# EAGLE design usb2ax_v3.0 (EAGLE 5.11)
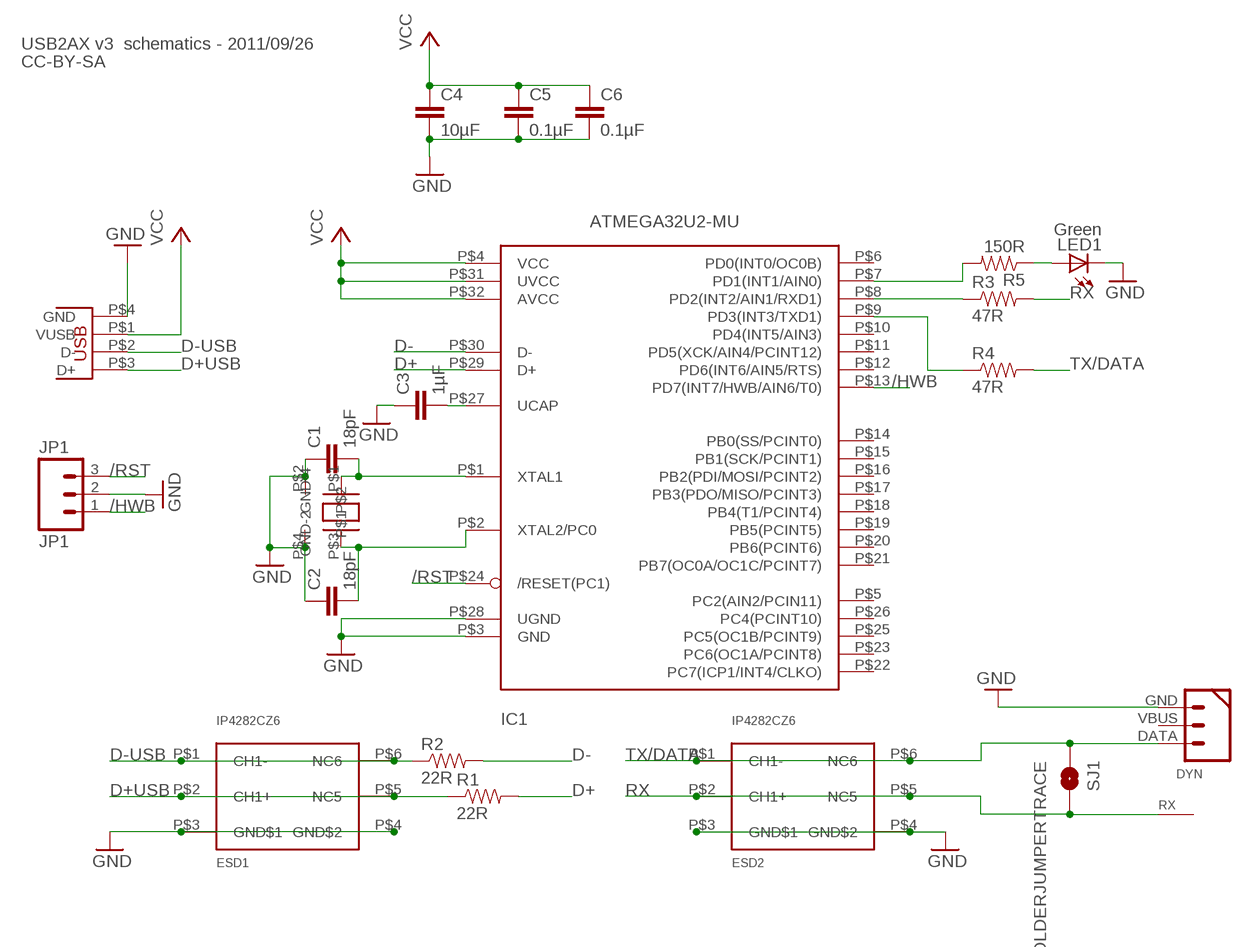
[diagram p0: schematic, sheet 1]

## Parts
C1  18pF  CAP0402-JLG  [0402-JLG]
C2  18pF  CAP0402-JLG  [0402-JLG]
C3  1µF  CAP0402-JLG  [0402-JLG]
C4  10µF  CAP0805  [0805]
C5  0.1µF  CAP0402-JLG  [0402-JLG]
C6  0.1µF  CAP0402-JLG  [0402-JLG]
DYN  DYNAMIXEL_3POS  [DYMANIXEL_3POS_RIGHT]
ESD1  IP4282CZ6  [SOT886]
ESD2  IP4282CZ6  [SOT886]
IC1  ATMEGA32U2-MU  ATMEGA32U2-AU  [QFN-32]
JP1  JP1  M031X03_NO_SILK  [1X03_NO_SILK]
LED1  Green  LED-0603  [0603-LED]
Q  CRYSTAL  [MODEL-403]
R1  22R  RESISTOR0402-JLG  [0402-JLG]
R2  22R  RESISTOR0402-JLG  [0402-JLG]
R3  47R  RESISTOR0402-JLG  [0402-JLG]
R4  47R  RESISTOR0402-JLG  [0402-JLG]
R5  150R  RESISTOR0402-JLG  [0402-JLG]
RX  PAD  [PAD_0.8]
SJ1  SOLDERJUMPERTRACE  [SJ_2S-TRACE]
USB  USB  USB-A-MALE-THT  [USB-A-THT]

## Nets
/HWB: IC1.P$13(PD7(INT7/HWB/AIN6/T0)) JP1.1
/RST: IC1.P$24(/RESET(PC1)) JP1.3
D+: IC1.P$29(D+) R1.P$2
D+USB: ESD1.P$2(CH1+) ESD1.P$5(NC5) R1.P$1 USB.P$3(D+)
D-: IC1.P$30(D-) R2.P$2
D-USB: ESD1.P$1(CH1-) ESD1.P$6(NC6) R2.P$1 USB.P$2(D-)
GND: C1.P$1 C2.P$1 C3.P$1 C4.2 C5.P$2 C6.P$2 DYN.GND ESD1.P$3(GND$1) ESD1.P$4(GND$2) ESD2.P$3(GND$1) ESD2.P$4(GND$2) IC1.P$3(GND) IC1.P$28(UGND) JP1.2 LED1.C Q.P$2(GND-2) Q.P$4(GND-4) USB.P$4(GND)
N$1: IC1.P$7(PD1(INT1/AIN0)) R5.P$2
N$3: C1.P$2 IC1.P$1(XTAL1) Q.P$1
N$4: C2.P$2 IC1.P$2(XTAL2/PC0) Q.P$3
N$5: IC1.P$8(PD2(INT2/AIN1/RXD1)) R3.P$1
N$10: C3.P$2 IC1.P$27(UCAP)
N$13: IC1.P$9(PD3(INT3/TXD1)) R4.P$1
N$14: LED1.A R5.P$1
RX: ESD2.P$2(CH1+) ESD2.P$5(NC5) R3.P$2 RX.PAD SJ1.2
TX/DATA: DYN.DATA ESD2.P$1(CH1-) ESD2.P$6(NC6) R4.P$2 SJ1.1
VCC: C4.1 C5.P$1 C6.P$1 IC1.P$4(VCC) IC1.P$31(UVCC) IC1.P$32(AVCC) USB.P$1(VUSB)
Unconnected: DYN.VBUS IC1.P$5(PC2(AIN2/PCIN11)) IC1.P$6(PD0(INT0/OC0B)) IC1.P$10(PD4(INT5/AIN3)) IC1.P$11(PD5(XCK/AIN4/PCINT12)) IC1.P$12(PD6(INT6/AIN5/RTS)) IC1.P$14(PB0(SS/PCINT0)) IC1.P$15(PB1(SCK/PCINT1)) IC1.P$16(PB2(PDI/MOSI/PCINT2)) IC1.P$17(PB3(PDO/MISO/PCINT3)) IC1.P$18(PB4(T1/PCINT4)) IC1.P$19(PB5(PCINT5)) IC1.P$20(PB6(PCINT6)) IC1.P$21(PB7(OC0A/OC1C/PCINT7)) IC1.P$22(PC7(ICP1/INT4/CLKO)) IC1.P$23(PC6(OC1A/PCINT8)) IC1.P$25(PC5(OC1B/PCINT9)) IC1.P$26(PC4(PCINT10))

## Notes on the sheet
- USB2AX v3  schematics - 2011/09/26
- CC-BY-SA

## Library data of the parts
C1-C6 = ParanoidStudio:CAP: Capacitor Standard 0603 ceramic capacitor, and 0.1" leaded capacitor.
DYN = ParanoidStudio:DYNAMIXEL_3POS
ESD1 ESD2 = ParanoidStudio:IP4282CZ6: Ultra-low capacitance ESD protection for high-speed interfaces
IC1 = ParanoidStudio:ATMEGA32U2: ATmega32u2 Pin compatible with the atmega8u2, atmega16u2 and atmega32u2 8, 16 or 32 K flash, 1K RAM, 512b EEPROM 8 bit and 16 bit timer (5 PWM total) UART, SPI (no I2C!) USB with 4 endpoints, LUFA compatible 22 I/O lines, analog comparator (no ADC!) Comes with DFU bootloader burned in!
JP1 = SparkFun-paranoidstudio:M03: Header 3 Standard 3-pin 0.1" header. Use with straight break away headers (SKU : PRT-00116), right angle break away headers (PRT-00553), swiss pins (PRT-00743), machine pins (PRT-00117), and female headers (PRT-00115). Molex polarized connector foot print use with SKU : PRT-08232 with associated crimp pins and housings.
LED1 = ParanoidStudio:LED
Q = ParanoidStudio:CRYSTAL
R1-R5 = ParanoidStudio:RESISTOR: Resistor Basic schematic elements and footprints for 0603, 1206, and PTH 1/10th watt (small) resistors.
RX = ParanoidStudio:PAD
SJ1 = SparkFun-paranoidstudio:SOLDERJUMPER: Solder Jumper Standard SMD solder jumper. Used to automate production. Two varients : Normally Open and Normally Closed are the same, but have different paste layers. NC will have a large amount of paste and should jumper during reflow.
USB = ParanoidStudio:USB

## Board
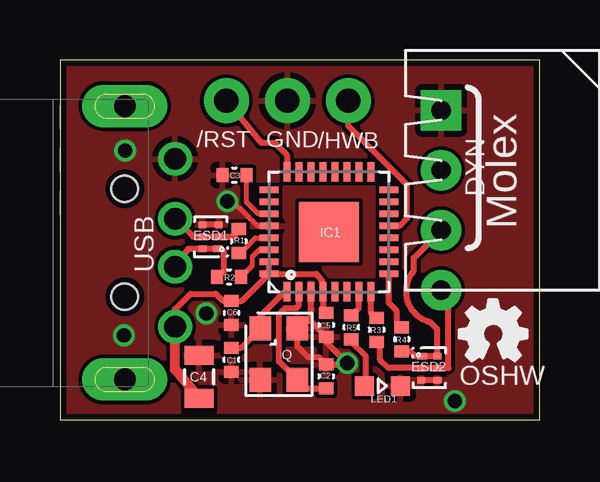
[diagram p1: board, top side]
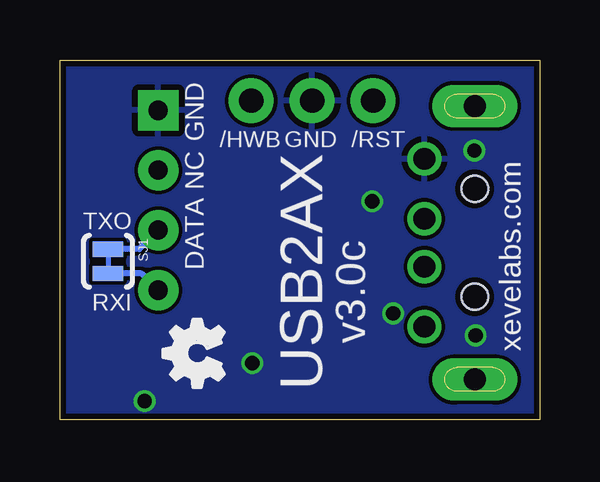
[diagram p2: board, bottom side, seen from below]

Size 20 x 15 mm. Coordinates in mm from the lower left corner, seen from the top.
Outline: 0,0 20,0 20,15 0,15 0,0
Copper layers (1*16): Top 0.035mm / dielectric 1.5mm / Bottom 0.035mm
Design rules "Fusion_eagle_rule_v1.1": minimum track width 6mil, minimum drill 12mil, track to track 6mil, track to pad 6mil, pad to pad 6mil, via to via 6mil, smd to smd 0mil, copper to edge 10mil, drill to drill 10mil, minimum pad ring 10mil, minimum via ring 6mil, stop-mask expansion 2mil, vias tented up to drill 100mil, thermal gap 10mil

### Footprints (pad centres in the part's own frame; a part is rotated, then mirrored left to right if it is on the bottom)
0402-JLG = smd 0.5 x 0.6: P$1 -0.5,0; P$2 0.5,0
0805 = smd 0.8 x 1.2: 1 -0.9,0; 2 0.9,0
DYMANIXEL_3POS_RIGHT = drill 0.8 pad 1.676 round: DATA 0,-5; VBUS 0,-2.5 | drill 0.8 pad 1.676 square: GND 0,0
SOT886 = smd 0.4 x 0.27: P$1 -0.3,0.5 | smd 0.325 x 0.27: P$2 -0.338,0; P$3 -0.338,-0.5; P$4 0.338,-0.5; P$5 0.338,0; P$6 0.338,0.5
QFN-32 = smd 0.285 x 0.8: P$1 -1.75,-2.5; P$2 -1.25,-2.5; P$3 -0.75,-2.5; P$4 -0.25,-2.5; P$5 0.25,-2.5; P$6 0.75,-2.5; P$7 1.25,-2.5; P$8 1.75,-2.5; P$17 1.75,2.5; P$18 1.25,2.5; P$19 0.75,2.5; P$20 0.25,2.5; P$21 -0.25,2.5; P$22 -0.75,2.5; P$23 -1.25,2.5; P$24 -1.75,2.5 | smd 0.8 x 0.285: P$9 2.5,-1.75; P$10 2.5,-1.25; P$11 2.5,-0.75; P$12 2.5,-0.25; P$13 2.5,0.25; P$14 2.5,0.75; P$15 2.5,1.25; P$16 2.5,1.75; P$25 -2.5,1.75; P$26 -2.5,1.25; P$27 -2.5,0.75; P$28 -2.5,0.25; P$29 -2.5,-0.25; P$30 -2.5,-0.75; P$31 -2.5,-1.25; P$32 -2.5,-1.75 | smd 2.5 x 2.5: P$33 0,0
1X03_NO_SILK = drill 1.016 pad 1.88 round: 1 0,0; 2 2.54,0; 3 5.08,0
0603-LED = smd 0.8 x 0.8: A -0.75,0; C 0.75,0
MODEL-403 = smd 1 x 0.9: P$1 -1.05,-0.75; P$2 1.1,-0.75; P$3 1.1,0.8; P$4 -1.05,0.8
PAD_0.8 = drill 0.8 pad 1.676 round: PAD 0,0
SJ_2S-TRACE = smd 0.635 x 1.27: 1 -0.508,0; 2 0.508,0
USB-A-THT = drill 0.9 round: P$1 2.1,-3.5; P$2 2.1,-1; P$3 2.1,1; P$4 2.1,3.5 | drill 0.9 pad 1.778 long: P$5 0,5.7; P$6 0,-5.7 | hole 1.1: 0,-2.25; 0,2.25

### Placement (x,y rotation side)
C1  7.15,2.5 90 top
C2  11.1,1.8 270 top
C3  7.28,10.2 0 top
C4  5.8,1.78 90 top
C5  11.1,3.95 270 top
C6  7.15,4.45 270 top
DYN  15.9,12.9 0 top
ESD1  6.29,7.63 180 top
ESD2  15.4,2.15 0 top
IC1  11.21,7.83 0 top
JP1  12.03,13.3 180 top
LED1  13.45,1.4 0 top
Q  9.1,2.75 270 top
R1  7.45,7.44 270 top
R2  7.05,5.95 0 top
R3  13.2,3.75 270 top
R4  14.25,3.35 270 top
R5  12.15,3.85 90 top
RX  15.9,5.4 0 top
SJ1  18,6.6 270 bottom
U$2  [OSHW_FILLX100_NOTEXT]  13.15,1.35 90 bottom
U$4  [OSHW_FILLX100_NOTEXT]  16.65,2.45 0 top
USB  2.7,7.38 0 top

### Tracks (layer width: path | path; a pad name or v marks a point on that pad's centre or on a via)
/HWB
  Top 0.254: IC1.P$13 14.15,8.08 14.47,8.4 14.47,9.8 12.03,12.25 JP1.1
/RST
  Top 0.254: IC1.P$24 9.46,11.04 8.95,11.55 8.39,11.55 JP1.3
D+
  Top 0.203: IC1.P$29 8.15,7.58 7.51,6.89 R1.P$2
D+USB
  Top 0.254: R1.P$1 7.29,7.63 ESD1.P$2 ESD1.P$5 5.54,7.63 USB.P$3
D-
  Top 0.203: IC1.P$30 8.3,7.08 8.03,6.8 8.03,6.42 R2.P$2
D-USB
  Top 0.254: R2.P$1 6.83,6.15 6.83,7 6.71,7.13 ESD1.P$1 ESD1.P$6 5.36,7.13 USB.P$2
GND  (via drill 0.6, 0.6 pad 0.25)
  Top 0.203: IC1.P$28 8.27,8.08 7.2,9.1 v6.97,9.1
  Top 0.254: ESD1.P$3 ESD1.P$4 | ESD2.P$3 ESD2.P$4 | Q.P$4 9.9,3.05 10.35,2.6 10.8,2.6 C2.P$1 11.93,2.3 v11.97,2.35 11.97,2.38 11.1,3.25 C5.P$2 10.46,4.08 IC1.P$3
  other vias: 6.1,4.42 2.67,3.51 16.47,0.77 2.72,11.22
  pour Bottom: -1.4,16.07 22.3,15.93 22.3,-1.95 -1.6,-1.75
  pour Top (rank 2): -0.9,15.75 20.9,15.45 20.98,-1.07 -0.88,-1.07
N$1
  Top 0.254: IC1.P$7 12.46,4.67 R5.P$2
N$3
  Top 0.254: IC1.P$1 9.37,5.32 8.35,4.3 Q.P$1 7.55,3 C1.P$2
N$4
  Top 0.254: IC1.P$2 9.96,4.76 9.85,4.65 9.4,4.65 9.13,4.38 9.13,2.42 Q.P$3 9.9,1.3 C2.P$2
N$5
  Top 0.254: IC1.P$8 12.96,4.46 R3.P$1
N$10
  Top 0.203: IC1.P$27 8.28,8.58 7.78,9.08 C3.P$2
N$13
  Top 0.254: IC1.P$9 13.71,4.87 14.05,4.53 14.05,4.05 R4.P$1
N$14
  Top 0.254: LED1.A 12.75,1.45 12.75,2.65 12.15,3.25 R5.P$1
RX
  Top 0.254: R3.P$2 13.35,3.1 13.35,2.5 13.7,2.15 ESD2.P$2 ESD2.P$5 16.2,2.15 16.2,5.1 RX.PAD
  Bottom 0.254: SJ1.2 16.59,6.09 RX.PAD
TX/DATA
  Top 0.254: DYN.DATA 14.75,6.75 14.75,6.2 arc115 15.45,4.05 15.74,3.76 ESD2.P$6 ESD2.P$1 14.8,2.65 14.6,2.85 R4.P$2
  Bottom 0.254: SJ1.1 16.69,7.11 DYN.DATA
VCC
  Top 0.254: IC1.P$32 IC1.P$31 | IC1.P$32 10.7,6.08 10.96,5.74 IC1.P$4 10.96,4.68 C5.P$1 | IC1.P$32 7.58,4.95 C6.P$1 6.8,4.95 6.5,5.25 5.45,5.25 4.8,4.6 USB.P$1
  Top 0.406: USB.P$1 4.8,2.09 C4.1

### Text on the board
tPlace: /RST | GND | /HWB | Molex | OSHW
bPlace: GND | /RST | GND | /HWB | NC | DATA | TXO | RXI | xevelabs.com | v3.0c | USB2AX
tNames: DYN | IC1 | USB